# Altium schematic sheet CONTROL_BOARD.SchDoc
size A3
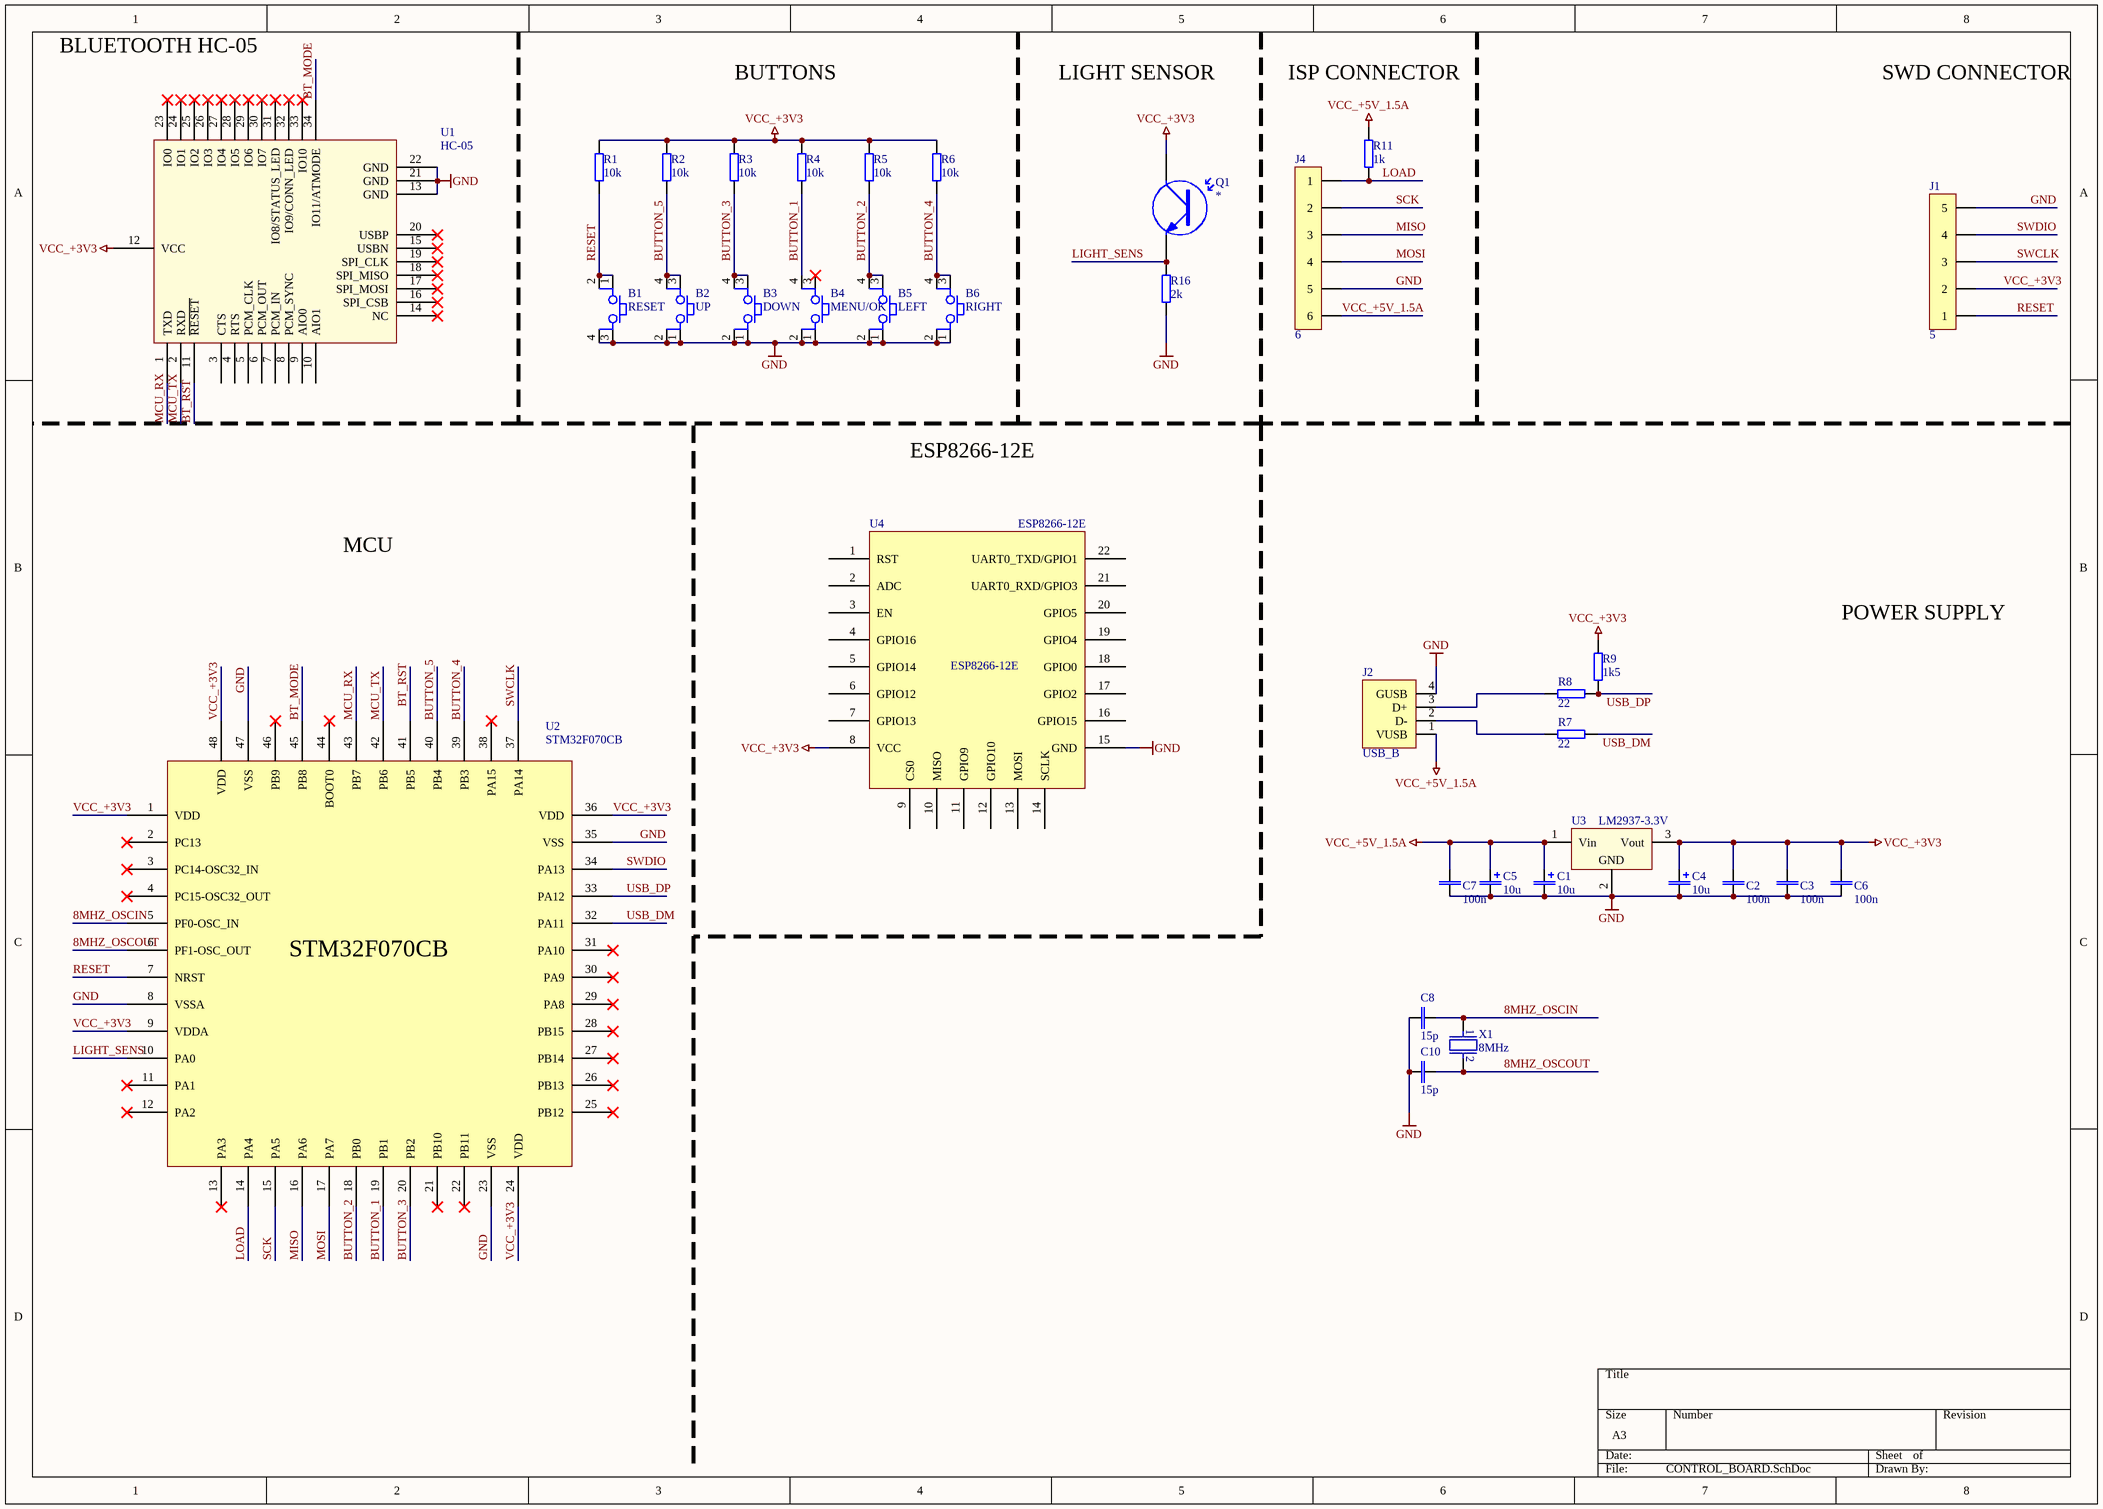
[diagram p0: CONTROL_BOARD.SchDoc]

## Parts
B1  RESET  [FP_BTN_SMD]
B2  UP  [FP_BTN_SMD]
B3  DOWN  [FP_BTN_SMD]
B4  MENU/OK  [FP_BTN_SMD]
B5  LEFT  [FP_BTN_SMD]
B6  RIGHT  [FP_BTN_SMD]
C1  10u  [CAP 1210]
C2  100n  [CAP 0805]
C3  100n  [CAP 0805]
C4  10u  [CAP 1210]
C5  10u  [CAP 1210]
C6  100n  [CAP 0805]
C7  100n  [CAP 0805]
C8  15p  [CAP 0805]
C10  15p  [CAP 0805]
J1  5  [SIL5]
J2  USB_B  [USB_B_STAND]
J4  6  [SIL6]
Q1  *  [HEADER2]
R1  10k  [RES 0805]
R2  10k  [RES 0805]
R3  10k  [RES 0805]
R4  10k  [RES 0805]
R5  10k  [RES 0805]
R6  10k  [RES 0805]
R7  22  [RES 0805]
R8  22  [RES 0805]
R9  1k5  [RES 0805]
R11  1k  [RES 0805]
R16  2k  [RES 0805]
U1  HC-05  [HC-05]
U2  STM32F070CB  [LQFP48]
U3  LM2937-3.3V  [SOT223]
U4  ESP8266-12E  [ESP8266-12E]
X1  8MHz  [QUARTZ_SMD]

## Nets
GND: B1.3 B1.4 B2.1 B2.2 B3.1 B3.2 B4.1 B4.2 B5.1 B5.2 B6.1 B6.2 C1.1 C2.1 C3.1 C4.1 C5.1 C6.1 C7.1 C8.2 C10.2 J1.5 J2.4(GUSB) J4.5 R16.2 U1.13(GND) U1.21(GND) U1.22(GND) U2.8(VSSA) U2.23(VSS) U2.35(VSS) U2.47(VSS) U3.2(GND) U4.15(GND)
VCC_+3V3: C2.2 C3.2 C4.2 C6.2 J1.2 Q1.1(C) R1.1 R2.1 R3.1 R4.1 R5.1 R6.1 R9.2 U1.12(VCC) U2.1(VDD) U2.9(VDDA) U2.24(VDD) U2.36(VDD) U2.48(VDD) U3.3(Vout) U4.8(VCC)
VCC_+5V_1.5A: C1.2 C5.2 C7.2 J2.1(VUSB) J4.6 R11.1 U3.1(Vin)
8MHZ_OSCIN: C8.1 U2.5(PF0-OSC_IN) X1.1
8MHZ_OSCOUT: C10.1 U2.6(PF1-OSC_OUT) X1.2
BT_MODE: U1.34(IO11/ATMODE) U2.45(PB8)
BT_RST: U1.11(~{RESET}) U2.41(PB5)
BUTTON_1: B4.4 R4.2 U2.19(PB1)
BUTTON_2: B5.3 B5.4 R5.2 U2.18(PB0)
BUTTON_3: B3.3 B3.4 R3.2 U2.20(PB2)
BUTTON_4: B6.3 B6.4 R6.2 U2.39(PB3)
BUTTON_5: B2.3 B2.4 R2.2 U2.40(PB4)
LIGHT_SENS: Q1.2(E) R16.1 U2.10(PA0)
LOAD: J4.1 R11.2 U2.14(PA4)
MCU_RX: U1.1(TXD) U2.43(PB7)
MCU_TX: U1.2(RXD) U2.42(PB6)
MISO: J4.3 U2.16(PA6)
MOSI: J4.4 U2.17(PA7)
RESET: B1.1 B1.2 J1.1 R1.2 U2.7(NRST)
SCK: J4.2 U2.15(PA5)
SWCLK: J1.3 U2.37(PA14)
SWDIO: J1.4 U2.34(PA13)
USB_DM: R7.1 U2.32(PA11)
USB_DP: R8.1 R9.1 U2.33(PA12)
NetJ2_2: J2.2(D-) R7.2
NetJ2_3: J2.3(D+) R8.2

Not connected (* = marked no-connect by the designer): B4 3*; U1 3(CTS) 4(RTS) 5(PCM_CLK) 6(PCM_OUT) 7(PCM_IN) 8(PCM_SYNC) 9(AIO0) 10(AIO1) 14(NC)* 15(USBN)* 16(SPI_CSB)* 17(SPI_MOSI)* 18(SPI_MISO)* 19(SPI_CLK)* 20(USBP)* 23(IO0)* 24(IO1)* 25(IO2)* 26(IO3)* 27(IO4)* 28(IO5)* 29(IO6)* 30(IO7)* 31(IO8/STATUS_LED)* 32(IO9/CONN_LED)* 33(IO10)*; U2 2(PC13)* 3(PC14-OSC32_IN)* 4(PC15-OSC32_OUT)* 11(PA1)* 12(PA2)* 13(PA3)* 21(PB10)* 22(PB11)* 25(PB12)* 26(PB13)* 27(PB14)* 28(PB15)* 29(PA8)* 30(PA9)* 31(PA10)* 38(PA15)* 44(BOOT0)* 46(PB9)*; U4 1(RST) 2(ADC) 3(EN) 4(GPIO16) 5(GPIO14) 6(GPIO12) 7(GPIO13) 9(CS0) 10(MISO) 11(GPIO9) 12(GPIO10) 13(MOSI) 14(SCLK) 16(GPIO15) 17(GPIO2) 18(GPIO0) 19(GPIO4) 20(GPIO5) 21(UART0_RXD/GPIO3) 22(UART0_TXD/GPIO1)

## Notes on the sheet
- BLUETOOTH HC-05
- BUTTONS
- LIGHT SENSOR
- ISP CONNECTOR
- SWD CONNECTOR
- ESP8266-12E
- MCU
- POWER SUPPLY

## Library data of the parts
B1-B6 = Button: Push button
  B1: Name: RESET
  B2: Name: UP
  B3: Name: DOWN
  B4: Name: MENU/OK
  B5: Name: LEFT
  B6: Name: RIGHT
C1 C4 C5 = CAP_POL: POLARIZED CAPACITOR; Value: 10u
C2 C3 C6-C8 C10 = CAP: NON POLARIZED CAPACITOR
  C2 C3 C6 C7: Value: 100n
  C8 C10: Value: 15p
J1 = HEADER5: 5 PIN HEADER; Value: 5
J2 = USB: USB_B TYPE CONNECTOR
J4 = HEADER6: 6 PIN HEADER; Value: 6
Q1 = Phototransistor: Value: *
R1-R9 R11 R16 = RES: RESISTOR
  R1-R6: Value: 10k
  R7 R8: Value: 22
  R9: Value: 1k5
  R11: Value: 1k
  R16: Value: 2k
U1 = HC-05: Blutooth Module (M/S); Value: HC-05
U2 = STM32F070CB_RB: 32bit ARM Cortex M0
U3 = LM2937: SOT223; Value: LM2937-3.3V
U4 = ESP8266-12E: WiFi module
X1 = QUARTZ: QUARTZ CRYSTAL; Value: 8MHz